# Altium project drake-1.PrjPcb
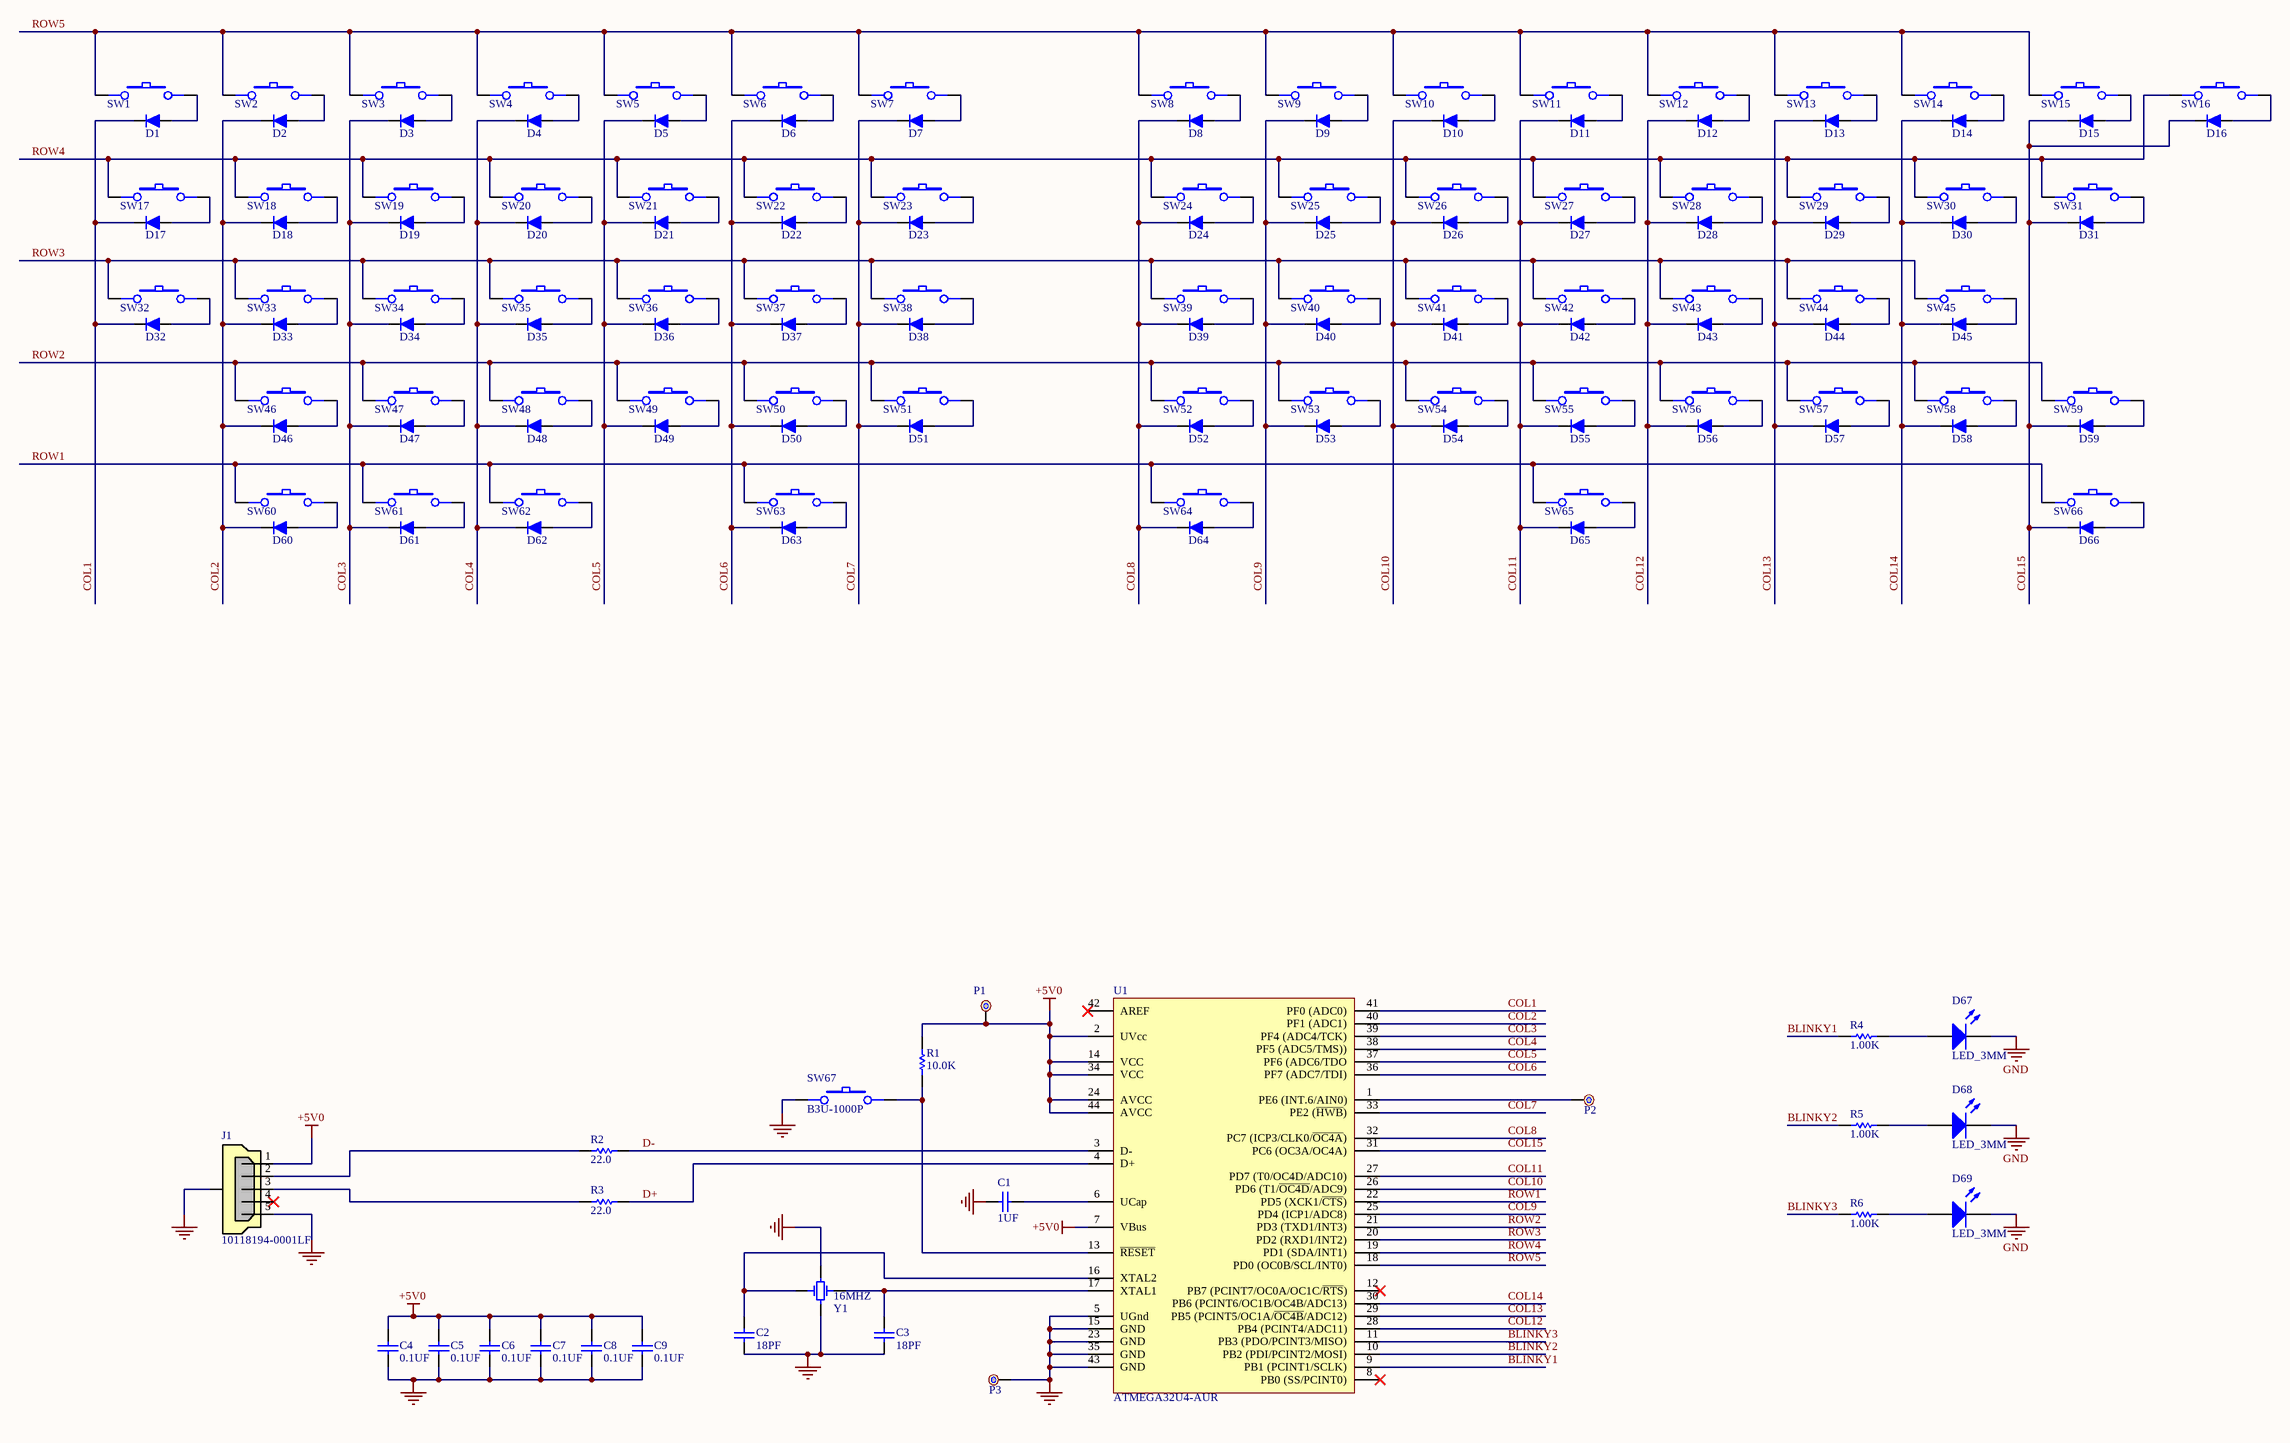
[diagram p0: drake-1.SchDoc]
1 sheet, 157 parts. Net scope: global (net labels, ports and power ports of the same name join across sheets).
Board file: drake-1.PcbDoc

## Sheet drake-1.SchDoc
size C

### Parts
C1  1UF  [CAPC2012X14N]
C2  18PF  [CAPC1005X06N]
C3  18PF  [CAPC1005X06N]
C4  0.1UF  [CAPC1005X06N]
C5  0.1UF  [CAPC1005X06N]
C6  0.1UF  [CAPC1005X06N]
C7  0.1UF  [CAPC1005X06N]
C8  0.1UF  [CAPC1005X06N]
C9  0.1UF  [CAPC1005X06N]
D1  1N4148WS-7-F  [SOD-323]  (value not drawn)
D2  1N4148WS-7-F  [SOD-323]  (value not drawn)
D3  1N4148WS-7-F  [SOD-323]  (value not drawn)
D4  1N4148WS-7-F  [SOD-323]  (value not drawn)
D5  1N4148WS-7-F  [SOD-323]  (value not drawn)
D6  1N4148WS-7-F  [SOD-323]  (value not drawn)
D7  1N4148WS-7-F  [SOD-323]  (value not drawn)
D8  1N4148WS-7-F  [SOD-323]  (value not drawn)
D9  1N4148WS-7-F  [SOD-323]  (value not drawn)
D10  1N4148WS-7-F  [SOD-323]  (value not drawn)
D11  1N4148WS-7-F  [SOD-323]  (value not drawn)
D12  1N4148WS-7-F  [SOD-323]  (value not drawn)
D13  1N4148WS-7-F  [SOD-323]  (value not drawn)
D14  1N4148WS-7-F  [SOD-323]  (value not drawn)
D15  1N4148WS-7-F  [SOD-323]  (value not drawn)
D16  1N4148WS-7-F  [SOD-323]  (value not drawn)
D17  1N4148WS-7-F  [SOD-323]  (value not drawn)
D18  1N4148WS-7-F  [SOD-323]  (value not drawn)
D19  1N4148WS-7-F  [SOD-323]  (value not drawn)
D20  1N4148WS-7-F  [SOD-323]  (value not drawn)
D21  1N4148WS-7-F  [SOD-323]  (value not drawn)
D22  1N4148WS-7-F  [SOD-323]  (value not drawn)
D23  1N4148WS-7-F  [SOD-323]  (value not drawn)
D24  1N4148WS-7-F  [SOD-323]  (value not drawn)
D25  1N4148WS-7-F  [SOD-323]  (value not drawn)
D26  1N4148WS-7-F  [SOD-323]  (value not drawn)
D27  1N4148WS-7-F  [SOD-323]  (value not drawn)
D28  1N4148WS-7-F  [SOD-323]  (value not drawn)
D29  1N4148WS-7-F  [SOD-323]  (value not drawn)
D30  1N4148WS-7-F  [SOD-323]  (value not drawn)
D31  1N4148WS-7-F  [SOD-323]  (value not drawn)
D32  1N4148WS-7-F  [SOD-323]  (value not drawn)
D33  1N4148WS-7-F  [SOD-323]  (value not drawn)
D34  1N4148WS-7-F  [SOD-323]  (value not drawn)
D35  1N4148WS-7-F  [SOD-323]  (value not drawn)
D36  1N4148WS-7-F  [SOD-323]  (value not drawn)
D37  1N4148WS-7-F  [SOD-323]  (value not drawn)
D38  1N4148WS-7-F  [SOD-323]  (value not drawn)
D39  1N4148WS-7-F  [SOD-323]  (value not drawn)
D40  1N4148WS-7-F  [SOD-323]  (value not drawn)
D41  1N4148WS-7-F  [SOD-323]  (value not drawn)
D42  1N4148WS-7-F  [SOD-323]  (value not drawn)
D43  1N4148WS-7-F  [SOD-323]  (value not drawn)
D44  1N4148WS-7-F  [SOD-323]  (value not drawn)
D45  1N4148WS-7-F  [SOD-323]  (value not drawn)
D46  1N4148WS-7-F  [SOD-323]  (value not drawn)
D47  1N4148WS-7-F  [SOD-323]  (value not drawn)
D48  1N4148WS-7-F  [SOD-323]  (value not drawn)
D49  1N4148WS-7-F  [SOD-323]  (value not drawn)
D50  1N4148WS-7-F  [SOD-323]  (value not drawn)
D51  1N4148WS-7-F  [SOD-323]  (value not drawn)
D52  1N4148WS-7-F  [SOD-323]  (value not drawn)
D53  1N4148WS-7-F  [SOD-323]  (value not drawn)
D54  1N4148WS-7-F  [SOD-323]  (value not drawn)
D55  1N4148WS-7-F  [SOD-323]  (value not drawn)
D56  1N4148WS-7-F  [SOD-323]  (value not drawn)
D57  1N4148WS-7-F  [SOD-323]  (value not drawn)
D58  1N4148WS-7-F  [SOD-323]  (value not drawn)
D59  1N4148WS-7-F  [SOD-323]  (value not drawn)
D60  1N4148WS-7-F  [SOD-323]  (value not drawn)
D61  1N4148WS-7-F  [SOD-323]  (value not drawn)
D62  1N4148WS-7-F  [SOD-323]  (value not drawn)
D63  1N4148WS-7-F  [SOD-323]  (value not drawn)
D64  1N4148WS-7-F  [SOD-323]  (value not drawn)
D65  1N4148WS-7-F  [SOD-323]  (value not drawn)
D66  1N4148WS-7-F  [SOD-323]  (value not drawn)
D67  LED_3MM  [LED T-1 3mm - straight]
D68  LED_3MM  [LED T-1 3mm - straight]
D69  LED_3MM  [LED T-1 3mm - straight]
J1  10118194-0001LF  [USB Micro 10118194]
P1  90MIL  [Pad_90mil_drill_55mil]  (value not drawn)  (no BOM)
P2  90MIL  [Pad_90mil_drill_55mil]  (value not drawn)  (no BOM)
P3  90MIL  [Pad_90mil_drill_55mil]  (value not drawn)  (no BOM)
R1  10.0K  [RESC1005X04N]
R2  22.0  [RESC1005X04N]
R3  22.0  [RESC1005X04N]
R4  1.00K  [RESC1005X04N]
R5  1.00K  [RESC1005X04N]
R6  1.00K  [RESC1005X04N]
SW1  MX1A-11NW  [SW-MX1A-11NW]  (value not drawn)
SW2  MX1A-11NW  [SW-MX1A-11NW]  (value not drawn)
SW3  MX1A-11NW  [SW-MX1A-11NW]  (value not drawn)
SW4  MX1A-11NW  [SW-MX1A-11NW]  (value not drawn)
SW5  MX1A-11NW  [SW-MX1A-11NW]  (value not drawn)
SW6  MX1A-11NW  [SW-MX1A-11NW]  (value not drawn)
SW7  MX1A-11NW  [SW-MX1A-11NW]  (value not drawn)
SW8  MX1A-11NW  [SW-MX1A-11NW]  (value not drawn)
SW9  MX1A-11NW  [SW-MX1A-11NW]  (value not drawn)
SW10  MX1A-11NW  [SW-MX1A-11NW]  (value not drawn)
SW11  MX1A-11NW  [SW-MX1A-11NW]  (value not drawn)
SW12  MX1A-11NW  [SW-MX1A-11NW]  (value not drawn)
SW13  MX1A-11NW  [SW-MX1A-11NW]  (value not drawn)
SW14  MX1A-11NW  [SW-MX1A-11NW]  (value not drawn)
SW15  MX1A-11NW  [SW-MX1A-11NW]  (value not drawn)
SW16  MX1A-11NW  [SW-MX1A-11NW]  (value not drawn)
SW17  MX1A-11NW  [SW-MX1A-11NW]  (value not drawn)
SW18  MX1A-11NW  [SW-MX1A-11NW]  (value not drawn)
SW19  MX1A-11NW  [SW-MX1A-11NW]  (value not drawn)
SW20  MX1A-11NW  [SW-MX1A-11NW]  (value not drawn)
SW21  MX1A-11NW  [SW-MX1A-11NW]  (value not drawn)
SW22  MX1A-11NW  [SW-MX1A-11NW]  (value not drawn)
SW23  MX1A-11NW  [SW-MX1A-11NW]  (value not drawn)
SW24  MX1A-11NW  [SW-MX1A-11NW]  (value not drawn)
SW25  MX1A-11NW  [SW-MX1A-11NW]  (value not drawn)
SW26  MX1A-11NW  [SW-MX1A-11NW]  (value not drawn)
SW27  MX1A-11NW  [SW-MX1A-11NW]  (value not drawn)
SW28  MX1A-11NW  [SW-MX1A-11NW]  (value not drawn)
SW29  MX1A-11NW  [SW-MX1A-11NW]  (value not drawn)
SW30  MX1A-11NW  [SW-MX1A-11NW]  (value not drawn)
SW31  MX1A-11NW  [SW-MX1A-11NW]  (value not drawn)
SW32  MX1A-11NW  [SW-MX1A-11NW]  (value not drawn)
SW33  MX1A-11NW  [SW-MX1A-11NW]  (value not drawn)
SW34  MX1A-11NW  [SW-MX1A-11NW]  (value not drawn)
SW35  MX1A-11NW  [SW-MX1A-11NW]  (value not drawn)
SW36  MX1A-11NW  [SW-MX1A-11NW]  (value not drawn)
SW37  MX1A-11NW  [SW-MX1A-11NW]  (value not drawn)
SW38  MX1A-11NW  [SW-MX1A-11NW]  (value not drawn)
SW39  MX1A-11NW  [SW-MX1A-11NW]  (value not drawn)
SW40  MX1A-11NW  [SW-MX1A-11NW]  (value not drawn)
SW41  MX1A-11NW  [SW-MX1A-11NW]  (value not drawn)
SW42  MX1A-11NW  [SW-MX1A-11NW]  (value not drawn)
SW43  MX1A-11NW  [SW-MX1A-11NW]  (value not drawn)
SW44  MX1A-11NW  [SW-MX1A-11NW]  (value not drawn)
SW45  MX1A-11NW  [SW-MX1A-11NW]  (value not drawn)
SW46  MX1A-11NW  [SW-MX1A-11NW]  (value not drawn)
SW47  MX1A-11NW  [SW-MX1A-11NW]  (value not drawn)
SW48  MX1A-11NW  [SW-MX1A-11NW]  (value not drawn)
SW49  MX1A-11NW  [SW-MX1A-11NW]  (value not drawn)
SW50  MX1A-11NW  [SW-MX1A-11NW]  (value not drawn)
SW51  MX1A-11NW  [SW-MX1A-11NW]  (value not drawn)
SW52  MX1A-11NW  [SW-MX1A-11NW]  (value not drawn)
SW53  MX1A-11NW  [SW-MX1A-11NW]  (value not drawn)
SW54  MX1A-11NW  [SW-MX1A-11NW]  (value not drawn)
SW55  MX1A-11NW  [SW-MX1A-11NW]  (value not drawn)
SW56  MX1A-11NW  [SW-MX1A-11NW]  (value not drawn)
SW57  MX1A-11NW  [SW-MX1A-11NW]  (value not drawn)
SW58  MX1A-11NW  [SW-MX1A-11NW]  (value not drawn)
SW59  MX1A-11NW  [SW-MX1A-11NW]  (value not drawn)
SW60  MX1A-11NW  [SW-MX1A-11NW]  (value not drawn)
SW61  MX1A-11NW  [SW-MX1A-11NW]  (value not drawn)
SW62  MX1A-11NW  [SW-MX1A-11NW]  (value not drawn)
SW63  MX1A-11NW  [SW-MX1A-11NW]  (value not drawn)
SW64  MX1A-11NW  [SW-MX1A-11NW]  (value not drawn)
SW65  MX1A-11NW  [SW-MX1A-11NW]  (value not drawn)
SW66  MX1A-11NW  [SW-MX1A-11NW]  (value not drawn)
SW67  B3U-1000P  [SW-B3U-1000P]
U1  ATMEGA32U4-AUR  [TQFP44-ATMEL]
Y1  16MHZ  [XTAL_3.2mmx2.5mm]

### Nets
+5V0: C4.2 C5.2 C6.2 C7.2 C8.2 C9.2 J1.1(VBUS) P1.1 R1.2 U1.2(UVcc) U1.7(VBus) U1.14(VCC) U1.24(AVCC) U1.34(VCC) U1.44(AVCC)
GND: C1.1 C2.1 C3.1 C4.1 C5.1 C6.1 C7.1 C8.1 C9.1 D67.1(K) D68.1(K) D69.1(K) J1.5(GND) J1.6(SHIELD) P3.1 SW67.1 U1.5(UGnd) U1.15(GND) U1.23(GND) U1.35(GND) U1.43(GND) Y1.2 Y1.4
BLINKY1: R4.1 U1.9(PB1_(PCINT1/SCLK))
BLINKY2: R5.1 U1.10(PB2_(PDI/PCINT2/MOSI))
BLINKY3: R6.1 U1.11(PB3_(PDO/PCINT3/MISO))
COL1: D1.1(K) D17.1(K) D32.1(K) U1.41(PF0_(ADC0))
COL2: D2.1(K) D18.1(K) D33.1(K) D46.1(K) D60.1(K) U1.40(PF1_(ADC1))
COL3: D3.1(K) D19.1(K) D34.1(K) D47.1(K) D61.1(K) U1.39(PF4_(ADC4/TCK))
COL4: D4.1(K) D20.1(K) D35.1(K) D48.1(K) D62.1(K) U1.38(PF5_(ADC5/TMS)))
COL5: D5.1(K) D21.1(K) D36.1(K) D49.1(K) U1.37(PF6_(ADC6/TDO)
COL6: D6.1(K) D22.1(K) D37.1(K) D50.1(K) D63.1(K) U1.36(PF7_(ADC7/TDI))
COL7: D7.1(K) D23.1(K) D38.1(K) D51.1(K) U1.33(PE2_(~{HWB}))
COL8: D8.1(K) D24.1(K) D39.1(K) D52.1(K) D64.1(K) U1.32(PC7_(ICP3/CLK0/~{OC4A}))
COL9: D9.1(K) D25.1(K) D40.1(K) D53.1(K) U1.25(PD4_(ICP1/ADC8))
COL10: D10.1(K) D26.1(K) D41.1(K) D54.1(K) U1.26(PD6_(T1/~{OC4D}/ADC9))
COL11: D11.1(K) D27.1(K) D42.1(K) D55.1(K) D65.1(K) U1.27(PD7_(T0/OC4D/ADC10))
COL12: D12.1(K) D28.1(K) D43.1(K) D56.1(K) U1.28(PB4_(PCINT4/ADC11))
COL13: D13.1(K) D29.1(K) D44.1(K) D57.1(K) U1.29(PB5_(PCINT5/OC1A/~{OC4B}/ADC12))
COL14: D14.1(K) D30.1(K) D45.1(K) D58.1(K) U1.30(PB6_(PCINT6/OC1B/OC4B/ADC13))
COL15: D15.1(K) D16.1(K) D31.1(K) D59.1(K) D66.1(K) U1.31(PC6_(OC3A/OC4A))
D+: R3.2 U1.4(D+)
D-: R2.2 U1.3(D-)
ROW1: SW60.2 SW61.2 SW62.2 SW63.2 SW64.2 SW65.2 SW66.2 U1.22(PD5_(XCK1/~{CTS}))
ROW2: SW46.2 SW47.2 SW48.2 SW49.2 SW50.2 SW51.2 SW52.2 SW53.2 SW54.2 SW55.2 SW56.2 SW57.2 SW58.2 SW59.2 U1.21(PD3_(TXD1/INT3))
ROW3: SW32.2 SW33.2 SW34.2 SW35.2 SW36.2 SW37.2 SW38.2 SW39.2 SW40.2 SW41.2 SW42.2 SW43.2 SW44.2 SW45.2 U1.20(PD2_(RXD1/INT2))
ROW4: SW16.2 SW17.2 SW18.2 SW19.2 SW20.2 SW21.2 SW22.2 SW23.2 SW24.2 SW25.2 SW26.2 SW27.2 SW28.2 SW29.2 SW30.2 SW31.2 U1.19(PD1_(SDA/INT1))
ROW5: SW1.2 SW2.2 SW3.2 SW4.2 SW5.2 SW6.2 SW7.2 SW8.2 SW9.2 SW10.2 SW11.2 SW12.2 SW13.2 SW14.2 SW15.2 U1.18(PD0_(OC0B/SCL/INT0))
NetC1_2: C1.2 U1.6(UCap)
NetC2_2: C2.2 U1.16(XTAL2) Y1.1
NetC3_2: C3.2 U1.17(XTAL1) Y1.3
NetD1_2: D1.2(A) SW1.1
NetD2_2: D2.2(A) SW2.1
NetD3_2: D3.2(A) SW3.1
NetD4_2: D4.2(A) SW4.1
NetD5_2: D5.2(A) SW5.1
NetD6_2: D6.2(A) SW6.1
NetD7_2: D7.2(A) SW7.1
NetD8_2: D8.2(A) SW8.1
NetD9_2: D9.2(A) SW9.1
NetD10_2: D10.2(A) SW10.1
NetD11_2: D11.2(A) SW11.1
NetD12_2: D12.2(A) SW12.1
NetD13_2: D13.2(A) SW13.1
NetD14_2: D14.2(A) SW14.1
NetD15_2: D15.2(A) SW15.1
NetD16_2: D16.2(A) SW16.1
NetD17_2: D17.2(A) SW17.1
NetD18_2: D18.2(A) SW18.1
NetD19_2: D19.2(A) SW19.1
NetD20_2: D20.2(A) SW20.1
NetD21_2: D21.2(A) SW21.1
NetD22_2: D22.2(A) SW22.1
NetD23_2: D23.2(A) SW23.1
NetD24_2: D24.2(A) SW24.1
NetD25_2: D25.2(A) SW25.1
NetD26_2: D26.2(A) SW26.1
NetD27_2: D27.2(A) SW27.1
NetD28_2: D28.2(A) SW28.1
NetD29_2: D29.2(A) SW29.1
NetD30_2: D30.2(A) SW30.1
NetD31_2: D31.2(A) SW31.1
NetD32_2: D32.2(A) SW32.1
NetD33_2: D33.2(A) SW33.1
NetD34_2: D34.2(A) SW34.1
NetD35_2: D35.2(A) SW35.1
NetD36_2: D36.2(A) SW36.1
NetD37_2: D37.2(A) SW37.1
NetD38_2: D38.2(A) SW38.1
NetD39_2: D39.2(A) SW39.1
NetD40_2: D40.2(A) SW40.1
NetD41_2: D41.2(A) SW41.1
NetD42_2: D42.2(A) SW42.1
NetD43_2: D43.2(A) SW43.1
NetD44_2: D44.2(A) SW44.1
NetD45_2: D45.2(A) SW45.1
NetD46_2: D46.2(A) SW46.1
NetD47_2: D47.2(A) SW47.1
NetD48_2: D48.2(A) SW48.1
NetD49_2: D49.2(A) SW49.1
NetD50_2: D50.2(A) SW50.1
NetD51_2: D51.2(A) SW51.1
NetD52_2: D52.2(A) SW52.1
NetD53_2: D53.2(A) SW53.1
NetD54_2: D54.2(A) SW54.1
NetD55_2: D55.2(A) SW55.1
NetD56_2: D56.2(A) SW56.1
NetD57_2: D57.2(A) SW57.1
NetD58_2: D58.2(A) SW58.1
NetD59_2: D59.2(A) SW59.1
NetD60_2: D60.2(A) SW60.1
NetD61_2: D61.2(A) SW61.1
NetD62_2: D62.2(A) SW62.1
NetD63_2: D63.2(A) SW63.1
NetD64_2: D64.2(A) SW64.1
NetD65_2: D65.2(A) SW65.1
NetD66_2: D66.2(A) SW66.1
NetD67_2: D67.2(A) R4.2
NetD68_2: D68.2(A) R5.2
NetD69_2: D69.2(A) R6.2
NetJ1_2: J1.2(D-) R2.1
NetJ1_3: J1.3(D+) R3.1
NetP2_1: P2.1 U1.1(PE6_(INT.6/AIN0))
NetR1_1: R1.1 SW67.2 U1.13(~{RESET})

Not connected (* = marked no-connect by the designer): J1 4(ID)*; U1 8(PB0_(SS/PCINT0))* 12(PB7_(PCINT7/OC0A/OC1C/~{RTS}))* 42(AREF)*

### Library data of the parts
C1 = 11-000132-001: =Reference; Manufacturer: Murata; Manufacturer Part Number: GRM21BR71A105KA01L; Voltage: 10V; Reference: CAP CER 1UF 10V 10% X7R 0805; Type: X7R; Tolerance: 10%; SysPN: 11-000132-001; Footprint: 0805; Value: 1UF; Supplier 1: DIGI-KEY; Supplier Part Number 1: 490-1695-2-ND
C2 C3 = 11-000025-001: =Reference; Manufacturer: Murata; Manufacturer Part Number: GRM1555C1H180JA01D; Voltage: 50; Reference: CAP CER 18PF 50V 5% NP0 0402; Type: C0G; Tolerance: +/-5%; SysPN: 11-000025-001; Footprint: 0402; Value: 18PF; Supplier 1: DIGI-KEY; Supplier Part Number 1: 490-1281-1-ND; RoHS: Y
C4-C9 = 11-000072-001: =Reference; Manufacturer: Murata; Manufacturer Part Number: GRM155R71C104KA88D; Voltage: 16; Reference: CAP CER 0.1UF 16V 10% X7R 0402; Type: X7R; Tolerance: +/-10%; SysPN: 11-000072-001; Footprint: 0402; Value: 0.1UF; Supplier 1: DIGI-KEY; Supplier Part Number 1: 490-3261-1-ND; RoHS: Y
D1-D66 = 1N4148WS-7-F: DIODE GEN PURP 75V 150MA SOD323; Manufacturer: Diodes Inc.; Manufacturer Part Number: 1N4148WS-7-F; Value: 1N4148WS-7-F; Reference: DIODE GEN PURP 75V 150MA SOD323; Supplier 1: Digi-Key; Supplier Part Number 1: 1N4148WS-FDICT-ND
D67-D69 = LED_3MM: LED 3MM; Value: Green; Supplier 1: Digi-Key
J1 = USB Micro 10118194-0001LF: USB - micro B; Manufacturer: Amphenol FCI; Manufacturer Part Number: 10118194-0001LF; Value: 10118194-0001LF; Reference: USB - micro B; Supplier 1: Digi-Key; Supplier Part Number 1: 609-4618-1-ND
P1-P3 = 26-900006-001: =Reference; Reference: PAD 90MIL DRILL 55MIL; SysPN: 26-900006-001; Value: 90MIL; Type: PAD
R1 = 23-000458-001: =Reference; Manufacturer: Vishay; Manufacturer Part Number: CRCW040210K0FKED; Voltage: 50; Power: 0.063; Reference: RES 10.0K OHM 1/16W 1% 0402 SMD; Tolerance: +/-1% +/-100PPM/K; SysPN: 23-000458-001; Footprint: 0402; Value: 10.0K; Type: Thick Film; Supplier 1: DIGI-KEY; Supplier Part Number 1: 541-10.0KLCT-ND; RoHS: Y
R2 R3 = 23-000152-001: =Reference; Manufacturer: Vishay; Manufacturer Part Number: CRCW040222R0FKED; Voltage: 50; Power: 0.063; Reference: RES 22.0 OHM 1/16W 1% 0402 SMD; Tolerance: +/-1% +/-100PPM/K; SysPN: 23-000152-001; Footprint: 0402; Value: 22.0; Type: Thick Film; Supplier 1: DIGI-KEY; Supplier Part Number 1: 541-22.0LCT-ND; RoHS: Y
R4-R6 = 23-000344-001: =Reference; Manufacturer: Vishay; Manufacturer Part Number: CRCW04021K00FKEDC; Voltage: 50; Power: 0.063; Reference: RES 1.00K OHM 1/16W 1% 0402 SMD; Tolerance: +/-1% +/-100PPM/K; SysPN: 23-000344-001; Footprint: 0402; Value: 1.00K; Type: Thick Film; Supplier 1: DIGI-KEY; Supplier Part Number 1: 541-1.00KLCT-ND; RoHS: Y
SW1-SW66 = SW-CHERRY-MX: SWITCH PUSH SPST-NO 0.01A 12V; Manufacturer: Cherry; Reference: SWITCH PUSH SPST-NO 0.01A 12V; Value: MX1A-11NW; Manufacturer Part Number: MX1A-11NW; Supplier 1: Digi-Key; Supplier Part Number 1: CH160-ND
SW67 = SW-B3U-1000P: SWITCH TACTILE SPST-NO 0.05A 12V; Manufacturer: Omron; Reference: SWITCH TACTILE SPST-NO 0.05A 12V; Value: B3U-1000P; Manufacturer Part Number: B3U-1000P; Supplier 1: Digi-Key; Supplier Part Number 1: SW1020CT-ND
U1 = ATMEGA32U4-AUR: IC MCU 8BIT 32KB FLASH 44TQFP; Manufacturer: Microchip; Manufacturer Part Number: ATMEGA32U4-AUR; Value: ATMEGA32U4-AUR; Reference: IC MCU 8BIT 32KB FLASH 44TQFP; Supplier 1: Digi-Key; Supplier Part Number 1: ATMEGA32U4-AURCT-ND
Y1 = 13-900017-001: =Reference; Manufacturer: Epson; Manufacturer Part Number: FA-238 16.0000MB-C3; Stability: +/-50PPM; Reference: CRYSTAL 16.0000MHZ 18PF SMD; Capacitance: 18PF; SysPN: 13-900017-001; Value: 16MHZ; Tolerance: +/-50PPM; Supplier 1: Digi-Key; Supplier Part Number 1: SER3686CT-ND; RoHS: Y